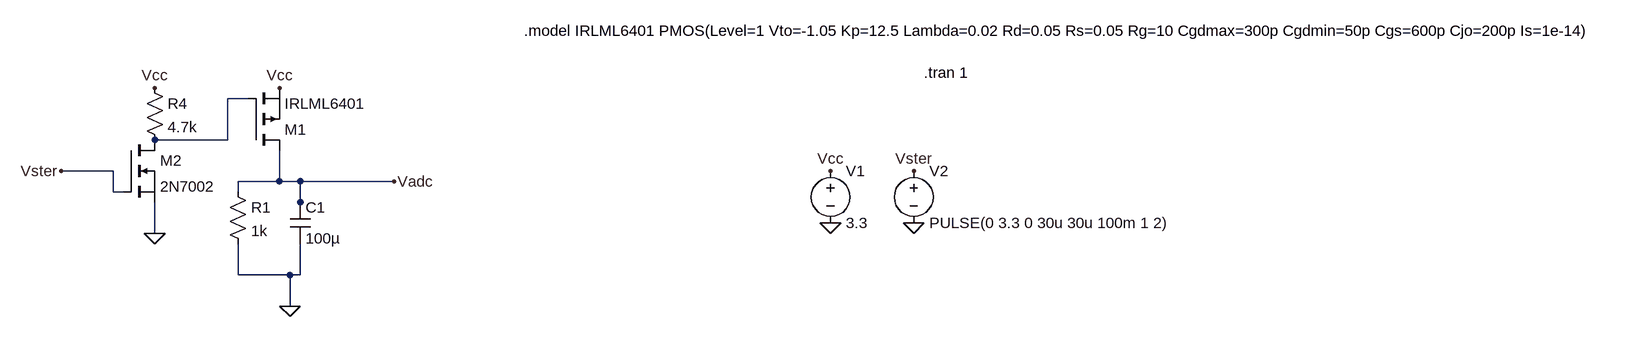
[diagram p0: schematic Pomiar_C.asc]
Pomiar_C.asc, the LTspice schematic file:
Version 4.1
SHEET 1 1832 680
WIRE -400 -32 -432 -32
WIRE -432 32 -432 -32
WIRE -432 32 -544 32
WIRE -608 80 -688 80
WIRE -352 96 -352 48
WIRE -352 96 -416 96
WIRE -320 96 -352 96
WIRE -176 96 -320 96
WIRE -608 112 -608 80
WIRE -592 112 -608 112
WIRE -416 112 -416 96
WIRE -320 128 -320 96
WIRE -320 144 -320 128
WIRE -544 176 -544 128
WIRE -416 240 -416 192
WIRE -336 240 -416 240
WIRE -320 240 -320 192
WIRE -320 240 -336 240
WIRE -336 288 -336 240
FLAG 496 80 Vcc
FLAG -352 -48 Vcc
FLAG 624 80 Vster
FLAG -688 80 Vster
FLAG 496 160 0
FLAG 624 160 0
FLAG -336 288 0
FLAG -544 -48 Vcc
FLAG -544 176 0
FLAG -176 96 Vadc
SYMBOL voltage 496 64 R0
WINDOW 123 0 0 Left 0
WINDOW 39 0 0 Left 0
SYMATTR InstName V1
SYMATTR Value 3.3
SYMBOL voltage 624 64 R0
WINDOW 123 0 0 Left 0
WINDOW 39 0 0 Left 0
SYMATTR InstName V2
SYMATTR Value PULSE(0 3.3 0 30u 30u 100m 1 2)
SYMBOL cap -336 128 R0
SYMATTR InstName C1
SYMATTR Value 100µ
SYMBOL res -432 96 R0
SYMATTR InstName R1
SYMATTR Value 1k
SYMATTR SpiceLine tol=0.1 pwr=0.25
SYMBOL res -560 -64 R0
SYMATTR InstName R4
SYMATTR Value 4.7k
SYMBOL pmos -400 48 M180
SYMATTR InstName M1
SYMATTR Value IRLML6401
SYMBOL nmos -592 32 R0
SYMATTR InstName M2
SYMATTR Value 2N7002
TEXT 640 -72 Left 2 !.tran 1
TEXT 24 -136 Left 2 !.model IRLML6401 PMOS(Level=1 Vto=-1.05 Kp=12.5 Lambda=0.02 Rd=0.05 Rs=0.05 Rg=10 Cgdmax=300p Cgdmin=50p Cgs=600p Cjo=200p Is=1e-14)

The netlist it stands for:
* Pomiar_C.asc
V1 Vcc 0 3.3
V2 Vster 0 PULSE(0 3.3 0 30u 30u 100m 1 2)
C1 Vadc 0 100µ
R1 Vadc 0 1k tol=0.1 pwr=0.25
R4 Vcc N001 4.7k
M1 Vadc N001 Vcc Vcc IRLML6401
M2 N001 Vster 0 0 2N7002
.model NMOS NMOS
.model PMOS PMOS
.lib standard.mos
.tran 1
.model IRLML6401 PMOS(Level=1 Vto=-1.05 Kp=12.5 Lambda=0.02 Rd=0.05 Rs=0.05 Rg=10 Cgdmax=300p Cgdmin=50p Cgs=600p Cjo=200p Is=1e-14)
.backanno
.end

* Results of the author's LTspice run, read from the files saved beside the schematic
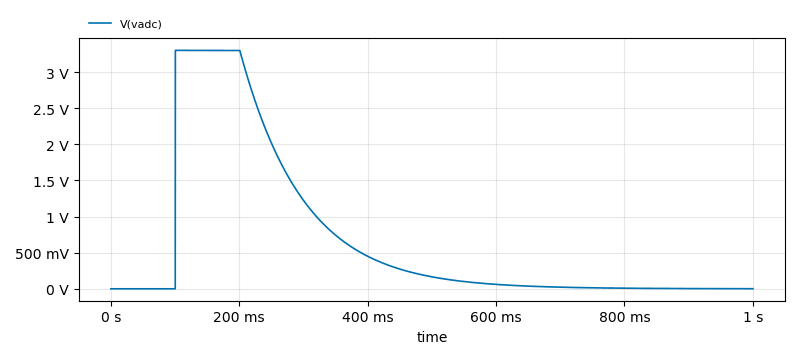
[diagram p1: Transient Analysis of Pomiar_C.asc, plotted from the saved traces]
* Transient Analysis, 1 run:
*   V(vadc): min 0 V, max 3.3 V, average 661.4 mV, rms 1.28 V, last 1.116 mV